# Altium project SBC5.PrjPcb (part 2 of 6)

## Sheet PMIC.SchDoc
size Tabloid; DocumentNumber: 2; SheetNumber: 2; SheetTotal: 13
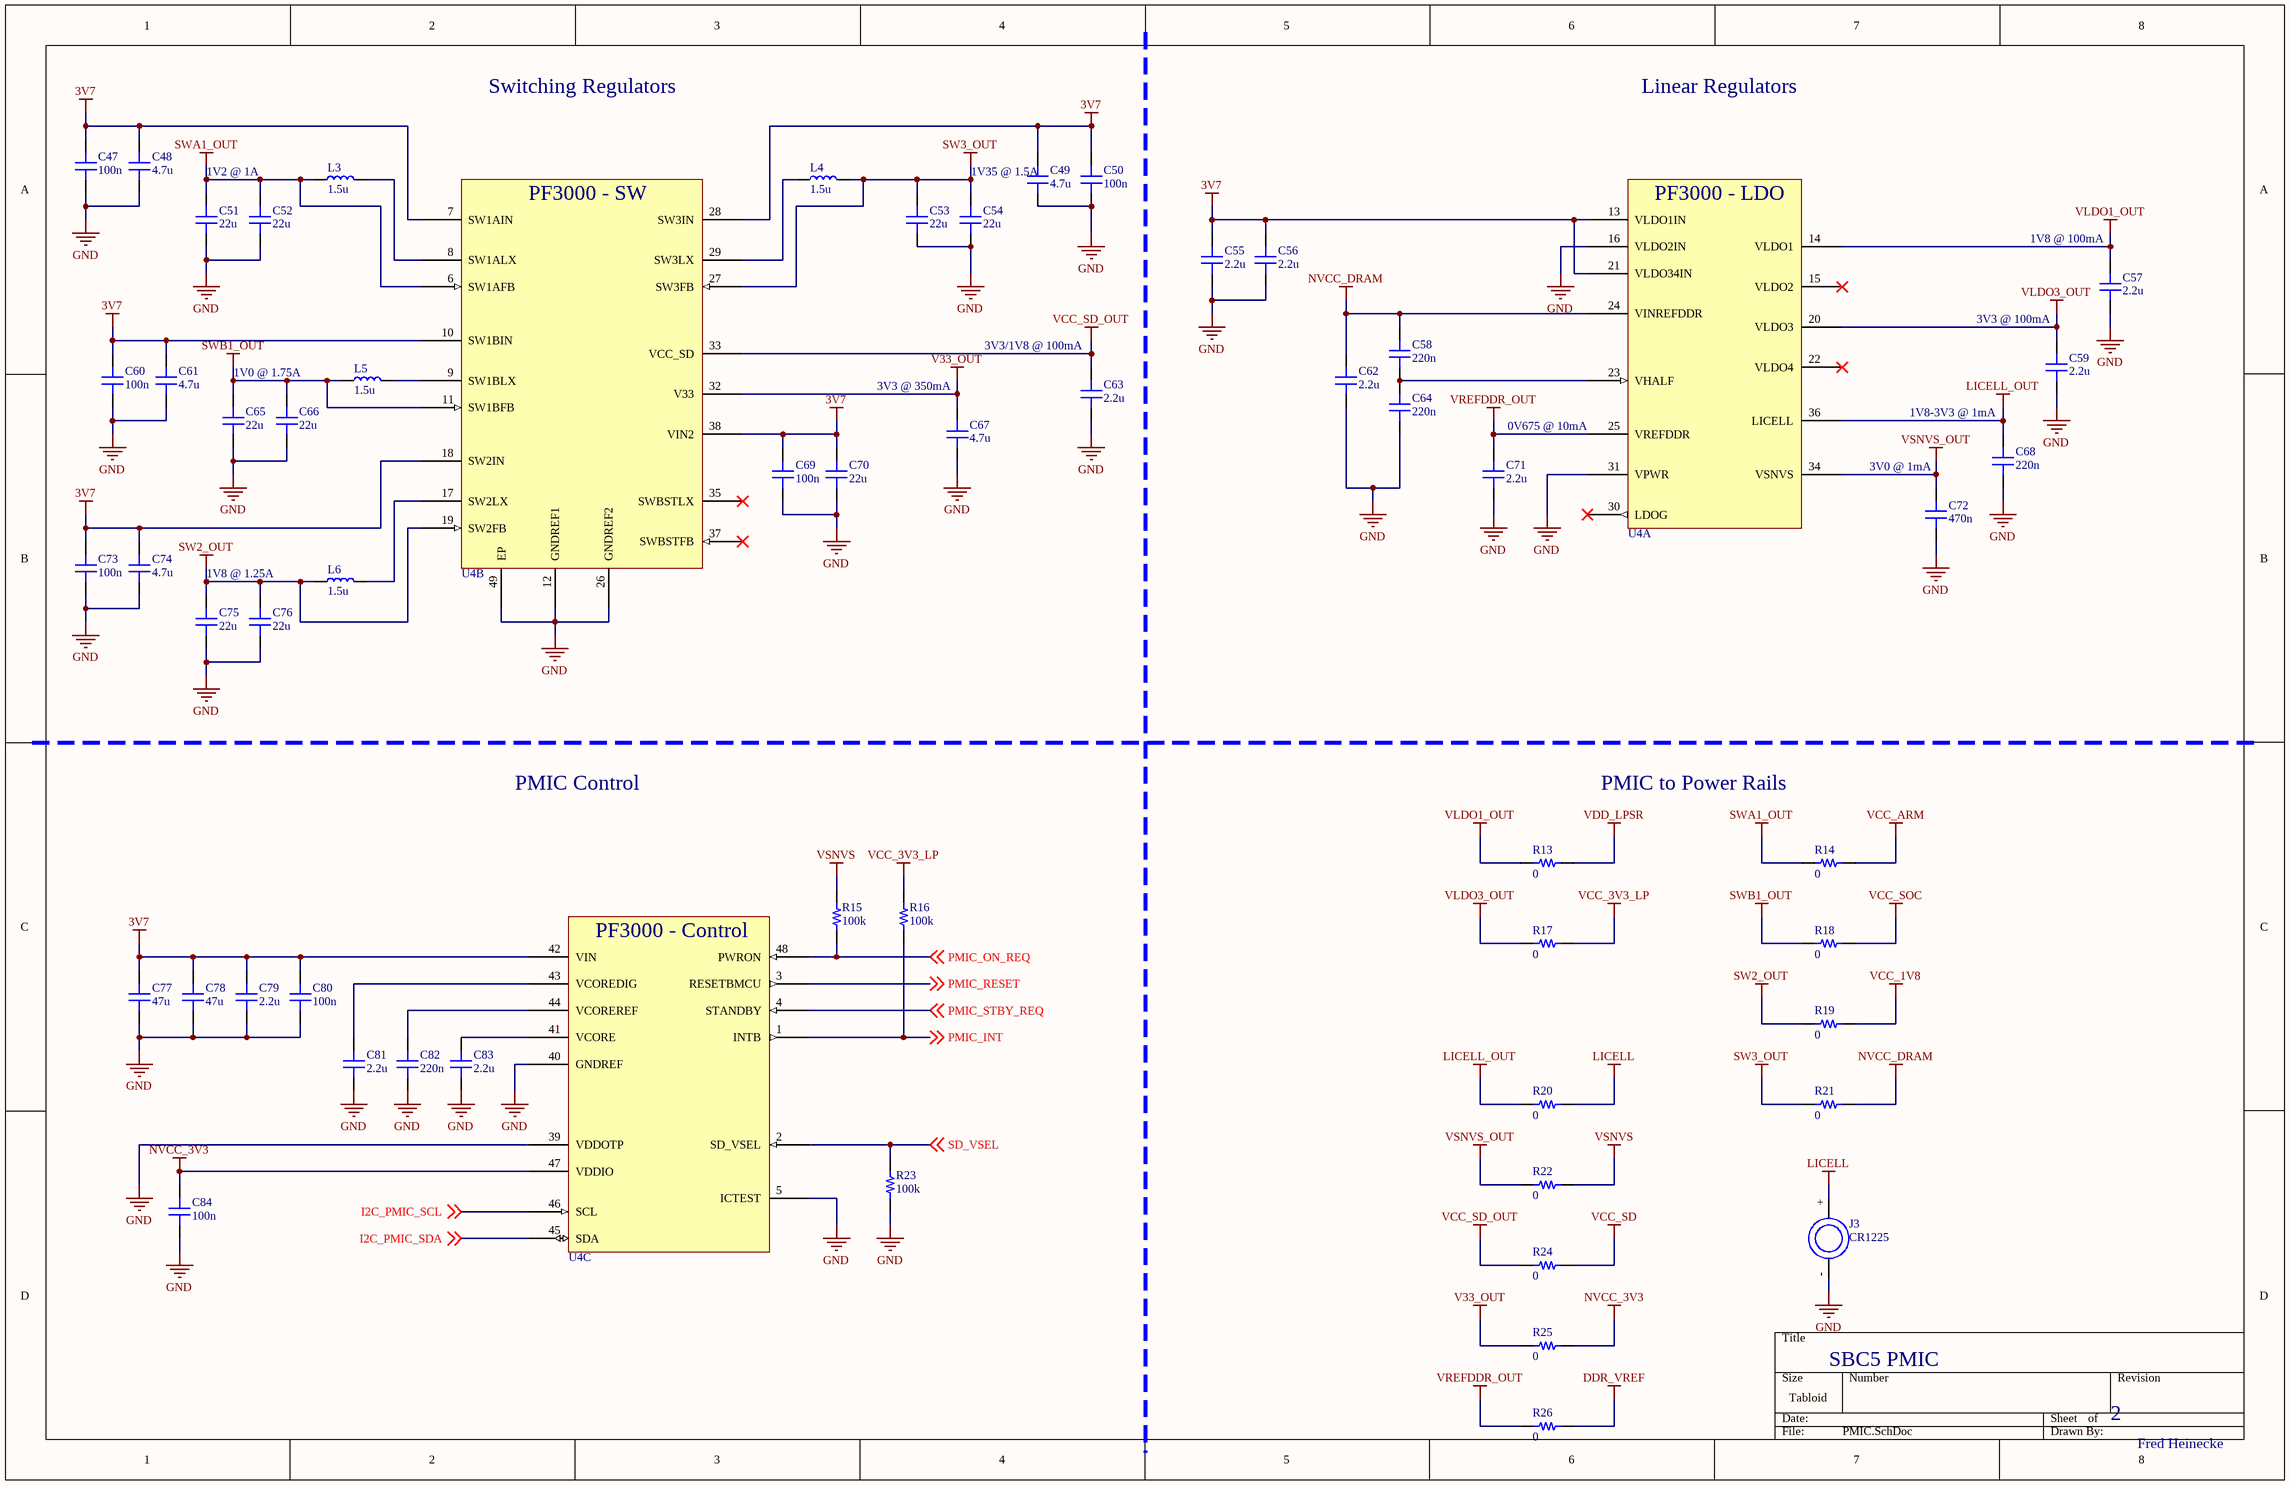
[diagram p1: PMIC.SchDoc]

### Parts
C47  100n  [C0201]
C48  4.7u  [C0603]
C49  4.7u  [C0603]
C50  100n  [C0201]
C51  22u  [C0603]
C52  22u  [C0603]
C53  22u  [C0603]
C54  22u  [C0603]
C55  2.2u  [C0402]
C56  2.2u  [C0402]
C57  2.2u  [C0402]
C58  220n  [C0201]
C59  2.2u  [C0402]
C60  100n  [C0201]
C61  4.7u  [C0603]
C62  2.2u  [C0402]
C63  2.2u  [C0402]
C64  220n  [C0201]
C65  22u  [C0603]
C66  22u  [C0603]
C67  4.7u  [C0603]
C68  220n  [C0201]
C69  100n  [C0201]
C70  22u  [C0603]
C71  2.2u  [C0402]
C72  470n  [C0402]
C73  100n  [C0201]
C74  4.7u  [C0603]
C75  22u  [C0603]
C76  22u  [C0603]
C77  47u  [C0805]
C78  47u  [C0805]
C79  2.2u  [C0402]
C80  100n  [C0201]
C81  2.2u  [C0402]
C82  220n  [C0201]
C83  2.2u  [C0402]
C84  100n  [C0201]
J3  CR1225  [BAT-HLD-012-THM]
L3  1.5u  [L0806]
L4  1.5u  [L0806]
L5  1.5u  [L0806]
L6  1.5u  [L0806]
R13  0  [R0402]
R14  0  [R0402]
R15  100k  [R0201]
R16  100k  [R0201]
R17  0  [R0402]
R18  0  [R0402]
R19  0  [R0402]
R20  0  [R0402]
R21  0  [R0402]
R22  0  [R0402]
R23  100k  [R0201]
R24  0  [R0402]
R25  0  [R0402]
R26  0  [R0402]
U4  PMIC  [PQFN50P700X700X90_HS-49N]  (value not drawn)  (parts A,B,C of 3)

### Nets
3V7: C47.2 C48.2 C49.2 C50.2 C55.2 C56.2 C60.2 C61.2 C69.2 C70.2 C73.2 C74.2 C77.2 C78.2 C79.2 C80.2 U4.7(SW1AIN) U4.10(SW1BIN) U4.13(VLDO1IN) U4.18(SW2IN) U4.21(VLDO34IN) U4.28(SW3IN) U4.38(VIN2) U4.42(VIN)
DDR_VREF: R26.2
GND: C47.1 C48.1 C49.1 C50.1 C51.1 C52.1 C53.1 C54.1 C55.1 C56.1 C57.1 C59.1 C60.1 C61.1 C62.1 C63.1 C64.1 C65.1 C66.1 C67.1 C68.1 C69.1 C70.1 C71.1 C72.1 C73.1 C74.1 C75.1 C76.1 C77.1 C78.1 C79.1 C80.1 C81.1 C82.1 C83.1 C84.1 J3.- R23.1 U4.5(ICTEST) U4.12(GNDREF1) U4.16(VLDO2IN) U4.26(GNDREF2) U4.31(VPWR) U4.39(VDDOTP) U4.40(GNDREF) U4.49(EP)
LICELL: J3.+ R20.2
LICELL_OUT: C68.2 R20.1 U4.36(LICELL)
NVCC_3V3: C84.2 R25.2 U4.47(VDDIO)
NVCC_DRAM: C58.2 C62.2 R21.2 U4.24(VINREFDDR)
SW2_OUT: C75.2 C76.2 L6.1 R19.1 U4.19(SW2FB)
SW3_OUT: C53.2 C54.2 L4.1 R21.1 U4.27(SW3FB)
SWA1_OUT: C51.2 C52.2 L3.1 R14.1 U4.6(SW1AFB)
SWB1_OUT: C65.2 C66.2 L5.1 R18.1 U4.11(SW1BFB)
V33_OUT: C67.2 R25.1 U4.32(V33)
VCC_1V8: R19.2
VCC_3V3_LP: R16.2 R17.2
VCC_ARM: R14.2
VCC_SD: R24.2
VCC_SD_OUT: C63.2 R24.1 U4.33(VCC_SD)
VCC_SOC: R18.2
VDD_LPSR: R13.2
VLDO1_OUT: C57.2 R13.1 U4.14(VLDO1)
VLDO3_OUT: C59.2 R17.1 U4.20(VLDO3)
VREFDDR_OUT: C71.2 R26.1 U4.25(VREFDDR)
VSNVS: R15.2 R22.2
VSNVS_OUT: C72.2 R22.1 U4.34(VSNVS)
I2C_PMIC_SCL: U4.46(SCL) ; off-sheet I2C_PMIC_SCL
I2C_PMIC_SDA: U4.45(SDA) ; off-sheet I2C_PMIC_SDA
PMIC_INT: R16.1 U4.1(INTB) ; off-sheet PMIC_INT
PMIC_ON_REQ: R15.1 U4.48(PWRON) ; off-sheet PMIC_ON_REQ
PMIC_RESET: U4.3(RESETBMCU) ; off-sheet PMIC_RESET
PMIC_STBY_REQ: U4.4(STANDBY) ; off-sheet PMIC_STBY_REQ
SD_VSEL: R23.2 U4.2(SD_VSEL) ; off-sheet SD_VSEL
NetC58_1: C58.1 C64.2 U4.23(VHALF)
NetC81_2: C81.2 U4.43(VCOREDIG)
NetC82_2: C82.2 U4.44(VCOREREF)
NetC83_2: C83.2 U4.41(VCORE)
NetL3_2: L3.2 U4.8(SW1ALX)
NetL4_2: L4.2 U4.29(SW3LX)
NetL5_2: L5.2 U4.9(SW1BLX)
NetL6_2: L6.2 U4.17(SW2LX)

Not connected (* = marked no-connect by the designer): U4 15(VLDO2)* 22(VLDO4)* 30(LDOG)* 35(SWBSTLX)* 37(SWBSTFB)*

### Notes on the sheet
- Switching Regulators
- Linear Regulators
- 1V2 @ 1A
- 1V35 @ 1.5A
- (near C57) 1V8 @ 100mA
- (near C63) 3V3/1V8 @ 100mA
- (near C59) 3V3 @ 100mA
- 1V0 @ 1.75A
- (near C67) 3V3 @ 350mA
- 0V675 @ 10mA
- (near C68) 1V8-3V3 @ 1mA
- (near C72) 3V0 @ 1mA
- 1V8 @ 1.25A
- PMIC Control
- PMIC to Power Rails
- SBC5 PMIC
- 2
- Fred Heinecke
- (in symbol MC34PF3000A4EP, part A) PF3000 - LDO
- (in symbol MC34PF3000A4EP, part B) PF3000 - SW
- (in symbol MC34PF3000A4EP, part C) PF3000 - Control

### Library data of the parts
C47 C50 C60 C69 C73 C80 C84 = GRM033R61C104KE84D: Multilayer Ceramic Capacitors MLCC - SMD/SMT 0201 0.10uF 16volts *Derate Voltage/Temp; Manufacturer: Murata; Capacitance: 100nF; Dielectric: X5R; Voltage Rating: 16V; Tolerance: 10%; Supplier 1: Digi-Key; Supplier Part Number 1: 490-9985-2-ND; Manufacturer Part Number: GRM033R61C104KE84D; RoHS: Yes; Category: Ceramic Capacitors; Stock 1: 2025000; Pricing 1: 15000=0.00770, 30000=0.00732 (USD); Mount: Surface Mount; Case/Package: 0201; Case Code (Metric): 0603; Case Code (Imperial): 0201; Weight: 1.2E-05oz; Min Operating Temperature: -55°C; Max Operating Temperature: 85°C; Packaging: Tape and Reel; Termination: SMD/SMT; Voltage Rating (DC): 16V; Package Quantity: 15000; Length: 0.6mm; Width: 0.012inch; Height: 0.3mm; Thickness: 0.013inch; REACH SVHC: No SVHC; Lead Free: Lead Free; RoHS Compliant: Yes; ComponentLink1URL: http://www.farnell.com/datasheets/2867836.pdf?src-supplier=Farnell; ComponentLink1Description: http://www.farnell.com/datasheets/2867836.pdf?src-supplier=Farnell; ComponentLink2URL: http://components.arrow.com/part/dataview/0323_07280039?src-supplier=Arrow+Europe; ComponentLink2Description: http://components.arrow.com/part/dataview/0323_07280039?src-supplier=Arrow+Europe; ComponentLink3URL: http://www.mouser.com/ds/2/281/c02e-2905.pdf?src-supplier=Mouser; ComponentLink3Description: http://www.mouser.com/ds/2/281/c02e-2905.pdf?src-supplier=Mouser; ComponentLink4URL: http://search.murata.co.jp/Ceramy/image/img/A01X/G101/ENG/GRM033R61C104KE84-01.pdf?src-supplier=Digi-Key; ComponentLink4Description: http://search.murata.co.jp/Ceramy/image/img/A01X/G101/ENG/GRM033R61C104KE84-01.pdf?src-supplier=Digi-Key; ComponentLink5URL: http://psearch.en.murata.com/capacitor/product/GRM033R61C104KE84%23.pdf?src-supplier=Avnet; ComponentLink5Description: http://psearch.en.murata.com/capacitor/product/GRM033R61C104KE84%23.pdf?src-supplier=Avnet; ComponentLink6URL: http://www.farnell.com/datasheets/2867836.pdf?src-supplier=Element14; ComponentLink6Description: http://www.farnell.com/datasheets/2867836.pdf?src-supplier=Element14
C48 C49 C61 C67 C74 = CL10A475KP8NNNC: Cap Ceramic 4.7uF 10V X5R 10% Pad SMD 0603 85C T/R; Manufacturer: Samsung; Supplier 1: Digi-Key; Supplier Part Number 1: 1276-1044-1-ND; Manufacturer Part Number: CL10A475KP8NNNC; RoHS: Yes; Category: Ceramic Capacitors; Stock 1: 3477192; Pricing 1: 1=0.10000, 10=0.04700, 50=0.02560, 100=0.02090, 500=0.01490, 1000=0.01171 (USD); Mount: Surface Mount; Case/Package: 0603; Case Code (Metric): 1608; Case Code (Imperial): 0603; Contact Plating: Tin; Min Operating Temperature: -55°C; Max Operating Temperature: 85°C; Tolerance: 10%; Capacitance: 4.7uF; Dielectric: X5R; Package Quantity: 1; Packaging: Tape and Reel; Voltage Rating: 10V; Series: CL; Construction: Flat; Length: 1.6mm; Width: 0.031inch; Height: 0.8mm; Thickness: 0.035inch; Depth: 0.8mm; Radiation Hardening: No; RoHS Compliant: Yes; ComponentLink1URL: https://datasheet.ciiva.com/25797/cl10a475kp8nnnc-25797520.pdf?src-supplier=Digi-Key; ComponentLink1Description: https://datasheet.ciiva.com/25797/cl10a475kp8nnnc-25797520.pdf?src-supplier=Digi-Key; ComponentLink2URL: https://datasheet.ciiva.com/26838/getdatasheetpartid-358676-26838384.pdf?src-supplier=Verical; ComponentLink2Description: https://datasheet.ciiva.com/26838/getdatasheetpartid-358676-26838384.pdf?src-supplier=Verical; ComponentLink3URL: https://datasheet.ciiva.com/16318/cl05b104kq5nnnc-16318245.pdf?src-supplier=Future+Electronics; ComponentLink3Description: https://datasheet.ciiva.com/16318/cl05b104kq5nnnc-16318245.pdf?src-supplier=Future+Electronics
C51-C54 C65 C66 C70 C75 C76 = GRM188R61A226ME15D: 0603 22 uF 10 V ±20% Tolerance X5R Multilayer Ceramic Chip Capacitor; Manufacturer: Murata; Capacitance: 22uF; Voltage Rating: 10V; Supplier 1: Digi-Key; Manufacturer Part Number: GRM188R61A226ME15D; RoHS: Yes; Category: Ceramic Capacitors; Stock 1: 1418007; Pricing 1: 1=0.30000, 10=0.20500, 50=0.13680, 100=0.11630, 500=0.08210, 1000=0.07184 (USD); Mount: Surface Mount; Case/Package: 0603; Case Code (Metric): 1608; Case Code (Imperial): 0603; Material: Ceramic; Weight: 0.000222oz; Min Operating Temperature: -55°C; Max Operating Temperature: 85°C; Tolerance: 20%; Packaging: Tape and Reel; Dielectric: X5R; Termination: SMD/SMT; Voltage Rating (DC): 10V; Package Quantity: 4000; Length: 1.6mm; Width: 0.8mm; Height: 0.8mm; Thickness: 0.039inch; Depth: 0.8mm; REACH SVHC: No SVHC; Lead Free: Lead Free; ComponentLink1URL: https://datasheet.ciiva.com/46444/1769893-46444975.pdf?src-supplier=Element14; ComponentLink1Description: https://datasheet.ciiva.com/46444/1769893-46444975.pdf?src-supplier=Element14; Supplier Part Number 1: 490-10476-1-ND
C55-C57 C59 C62 C63 C71 C79 C81 C83 = LMK105BJ225MV-F: TAIYO YUDEN         LMK105BJ225MV-F            CERAMIC CAPACITOR, 2.2UF, 10V, X5R, 20%, 0402; Supplier 1: Digi-Key; Manufacturer: Taiyo Yuden; Manufacturer Part Number: LMK105BJ225MV-F; RoHS: Yes; Category: Ceramic Capacitors; Stock 1: 422093; Pricing 1: 1=0.10000, 10=0.05800, 50=0.03160, 100=0.02590, 500=0.01848, 1000=0.01452, 2500=0.01320, 5000=0.01214 (USD); Mount: Surface Mount; Case/Package: 0402; Case Code (Imperial): 0402; Case Code (Metric): 1005; Min Operating Temperature: -55°C; Max Operating Temperature: 85°C; Termination: SMD/SMT; Packaging: Tape and Reel; Capacitance: 2.2uF; Tolerance: 20%; Voltage Rating: 10V; Package Quantity: 1; Voltage Rating (DC): 10V; Dielectric: X5R; Resistor Type: Ceramic; Length: 1mm; Width: 0.5mm; Height: 0.5mm; Thickness: 0.022inch; Depth: 0.5mm; Radiation Hardening: No; Halogen Free: Halogen Free; REACH SVHC: Unknown; ComponentLink1URL: https://datasheet.ciiva.com/30190/500lmk105bj225mv-f-30190498.pdf?src-supplier=Onlinecomponents.com; ComponentLink1Description: https://datasheet.ciiva.com/30190/500lmk105bj225mv-f-30190498.pdf?src-supplier=Onlinecomponents.com; ComponentLink2URL: https://datasheet.ciiva.com/23631/lmk105bj225mv-f-ss-23631491.pdf?src-supplier=Newark; ComponentLink2Description: https://datasheet.ciiva.com/23631/lmk105bj225mv-f-ss-23631491.pdf?src-supplier=Newark; ComponentLink3URL: https://datasheet.ciiva.com/134/lmk105bj225mv-f-ss-134677.pdf?src-supplier=Digi-Key; ComponentLink3Description: https://datasheet.ciiva.com/134/lmk105bj225mv-f-ss-134677.pdf?src-supplier=Digi-Key; ComponentLink4URL: https://datasheet.ciiva.com/15921/286lmk105bj225mv-f-15921222.pdf?src-supplier=Onlinecomponents.com; ComponentLink4Description: https://datasheet.ciiva.com/15921/286lmk105bj225mv-f-15921222.pdf?src-supplier=Onlinecomponents.com; Supplier Part Number 1: 587-3153-1-ND
C58 C64 C68 C82 = GRM033R61C224KE14D: Cap Ceramic Monolithic 0.22uF 16VDC 10% SMD Paper T/R; Manufacturer: Murata; Supplier 1: Digi-Key; Manufacturer Part Number: GRM033R61C224KE14D; RoHS: No; Stock 1: 16192; Pricing 1: 1=0.10000, 10=0.03900, 50=0.02120, 100=0.01720, 500=0.01232, 1000=0.00968, 2500=0.00880, 5000=0.00810 (USD); ComponentLink1URL: https://search.murata.co.jp/Ceramy/image/img/A01X/G101/ENG/GRM033R61C224KE14-01.pdf?src-supplier=Digi-Key; ComponentLink1Description: https://search.murata.co.jp/Ceramy/image/img/A01X/G101/ENG/GRM033R61C224KE14-01.pdf?src-supplier=Digi-Key; Supplier Part Number 1: 490-17040-1-ND
C72 = CL05A474KP5NNNC: Cap Ceramic 0.47uF 10V X5R 10% SMD 0402 85C T/R; Manufacturer: Samsung; Capacitance: 470nF; Supplier 1: Digi-Key; Supplier Part Number 1: 1276-1173-1-ND; Manufacturer Part Number: CL05A474KP5NNNC; RoHS: Yes; Category: Ceramic Capacitors; Stock 1: 1598783; Pricing 1: 1=0.10000, 10=0.06000, 50=0.03260, 100=0.02670, 500=0.01906, 1000=0.01497, 2500=0.01361, 5000=0.01252 (USD); Mount: Surface Mount; Case/Package: 0402; Case Code (Metric): 1005; Case Code (Imperial): 0402; Min Operating Temperature: -55°C; Max Operating Temperature: 85°C; Tolerance: 10%; Dielectric: X5R; Packaging: Tape and Reel; Voltage Rating: 10V; Voltage Rating (DC): 10V; Series: CL; Construction: Flat; Length: 1mm; Width: 0.02inch; Height: 0.5mm; Thickness: 0.022inch; Depth: 0.5mm; Radiation Hardening: No; Lead Free: Lead Free; RoHS Compliant: Yes; ComponentLink1URL: https://datasheet.ciiva.com/25710/cl05a474kp5nnnc-25710324.pdf?src-supplier=Digi-Key; ComponentLink1Description: https://datasheet.ciiva.com/25710/cl05a474kp5nnnc-25710324.pdf?src-supplier=Digi-Key; ComponentLink2URL: https://datasheet.ciiva.com/26838/getdatasheetpartid-355286-26838191.pdf?src-supplier=Verical; ComponentLink2Description: https://datasheet.ciiva.com/26838/getdatasheetpartid-355286-26838191.pdf?src-supplier=Verical; ComponentLink3URL: https://datasheet.ciiva.com/16437/cl05b104kq5nnnc-16437351.pdf?src-supplier=Future+Electronics; ComponentLink3Description: https://datasheet.ciiva.com/16437/cl05b104kq5nnnc-16437351.pdf?src-supplier=Future+Electronics
C77 C78 = C2012X5R1A476M125AC: TDK   C2012X5R1A476M125AC   SMD Multilayer Ceramic Capacitor, C Series, 47 F,  20%, X5R, 10 V, 0805 [2012 Metric]; Capacitance: 47uF; Voltage Rating: 10V; Supplier 1: Digi-Key; Supplier Part Number 1: 445-8239-1-ND; Manufacturer: TDK; Manufacturer Part Number: C2012X5R1A476M125AC; RoHS: Yes; Category: Ceramic Capacitors; Stock 1: 147108; Pricing 1: 1=0.85000, 10=0.64400, 50=0.53460, 100=0.46040, 500=0.35640, 1000=0.30690 (USD); Mount: Surface Mount; Case/Package: 0805; Case Code (Metric): 2012; Case Code (Imperial): 0805; Dielectric Material: Ceramic; Weight: 0.000194oz; Min Operating Temperature: -55°C; Max Operating Temperature: 85°C; Tolerance: 20%; Packaging: Tape and Reel; Voltage Rating (DC): 10V; Dielectric: X5R; Termination: SMD/SMT; Package Quantity: 1; Resistor Type: Ceramic; Voltage: 10V; Series: C; Length: 2mm; Width: 0.049inch; Height: 1.25mm; Depth: 1.25mm; Thickness: 0.057inch; REACH SVHC: No SVHC; Lead Free: Lead Free; RoHS Compliant: Yes; ComponentLink1URL: https://datasheet.ciiva.com/24216/c2012x5r1a476m125ac-264921-24216523.pdf?src-supplier=Mouser; ComponentLink1Description: https://datasheet.ciiva.com/24216/c2012x5r1a476m125ac-264921-24216523.pdf?src-supplier=Mouser; ComponentLink2URL: https://datasheet.ciiva.com/24191/c2012x5r1a476m125ac-24191773.pdf?src-supplier=Future+Electronics; ComponentLink2Description: https://datasheet.ciiva.com/24191/c2012x5r1a476m125ac-24191773.pdf?src-supplier=Future+Electronics; ComponentLink3URL: https://datasheet.ciiva.com/6259/tdkmlcccaprange-6259575.pdf?src-supplier=Digi-Key; ComponentLink3Description: https://datasheet.ciiva.com/6259/tdkmlcccaprange-6259575.pdf?src-supplier=Digi-Key; ComponentLink4URL: https://datasheet.ciiva.com/6259/tdkmlcccaprange-6259576.pdf?src-supplier=Digi-Key; ComponentLink4Description: https://datasheet.ciiva.com/6259/tdkmlcccaprange-6259576.pdf?src-supplier=Digi-Key; ComponentLink5URL: https://datasheet.ciiva.com/6259/tdkmlcccaprange-6259577.pdf?src-supplier=Digi-Key; ComponentLink5Description: https://datasheet.ciiva.com/6259/tdkmlcccaprange-6259577.pdf?src-supplier=Digi-Key; ComponentLink6URL: https://datasheet.ciiva.com/7975/1796654-7975085.pdf?src-supplier=Element14; ComponentLink6Description: https://datasheet.ciiva.com/7975/1796654-7975085.pdf?src-supplier=Element14; ComponentLink7URL: https://datasheet.ciiva.com/22694/1796654-22694142.pdf?src-supplier=Element14; ComponentLink7Description: https://datasheet.ciiva.com/22694/1796654-22694142.pdf?src-supplier=Element14
J3 = BAT-HLD-012-THM: BATTERY RETAINER COIN PC PIN; Manufacturer: Linx; Number of Cells: 1; Supplier 1: Digi-Key; Supplier Part Number 1: BAT-HLD-012-THM-ND; Manufacturer Part Number: BAT-HLD-012-THM; RoHS: Yes; Category: Uncategorized; Stock 1: 1284; Pricing 1: 1=0.29000, 10=0.27800, 25=0.26600, 100=0.24100, 250=0.23000, 500=0.21900, 1000=0.19600, 2000=0.18000, 5000=0.17765 (USD); Mount: Through Hole,PCB; Termination: PC Pin; Package Quantity: 1000; Number of Batteries: 1; Lead Free: Lead Free; ComponentLink1URL: https://datasheet.ciiva.com/4/bat-hld-012-thm-4039.pdf?src-supplier=Digi-Key; ComponentLink1Description: https://datasheet.ciiva.com/4/bat-hld-012-thm-4039.pdf?src-supplier=Digi-Key; ComponentLink2URL: https://datasheet.ciiva.com/4642/bat-hld-012-thm20diagram-201689-4642575.pdf?src-supplier=Mouser; ComponentLink2Description: https://datasheet.ciiva.com/4642/bat-hld-012-thm20diagram-201689-4642575.pdf?src-supplier=Mouser
L3-L6 = DFE201610E-1R5M=P2: Inductor Power Shielded Wirewound 1.5uH 20% 1MHz Metal 2.1A 0.091Ohm DCR 0806 T/R; Manufacturer: Murata; Supplier 1: Digi-Key; Supplier Part Number 1: 490-18107-1-ND; Manufacturer Part Number: DFE201610E-1R5M=P2; RoHS: Yes; Category: Fixed Inductors; Stock 1: 1449; Pricing 1: 1=0.42000, 10=0.36800, 25=0.34120, 50=0.28880, 100=0.26250, 250=0.24676, 500=0.22050, 1000=0.17850 (USD); RoHS Compliant: Yes
R13 R14 R17-R22 R24-R26 = RMCF0402ZT0R00: RES 0 OHM JUMPER 1/16W 0402; Manufacturer: Stackpole Electronics; Resistance: 0R; Power Rating: 63mW; Current Rating: 1A; Working Voltage: 50V; Supplier 1: Digi-Key; Supplier Part Number 1: RMCF0402ZT0R00CT-ND; Manufacturer Part Number: RMCF0402ZT0R00; RoHS: Yes; Category: Chip SMD Resistors; Stock 1: 7645981; Pricing 1: 1=0.10000, 10=0.01000, 25=0.00720, 50=0.00560, 100=0.00410, 250=0.00316, 500=0.00252, 1000=0.00186, 5000=0.00133 (USD); Mount: Surface Mount; Case/Package: 0402; Case Code (Metric): 1005; Case Code (Imperial): 0402; Contact Plating: Tin,Matte; Min Operating Temperature: -55°C; Max Operating Temperature: 155°C; Packaging: Tape and Reel; Resistor Type: Thick Film; Number of Terminations: 2; Max Power Dissipation: 63mW; Features: Automotive AEC-Q200; Series: RMCF; Technology: THICK FILM; Construction: Rectangular; Length: 0.039inch; Width: 0.02inch; Height: 0.016inch; Depth: 0.5mm; Radiation Hardening: No; Military Standard: Not; Lead Free: Lead Free; RoHS Compliant: Yes; ComponentLink1URL: https://datasheet.ciiva.com/26835/getdatasheetpartid-409751-26835612.pdf?src-supplier=Verical; ComponentLink1Description: https://datasheet.ciiva.com/26835/getdatasheetpartid-409751-26835612.pdf?src-supplier=Verical
R15 R16 R23 = ERJ-1GNF1003C: PANASONIC - ERJ1GNF1003C - RES, 100K, 1%, 0.05W, 0201, THICK FILM; Resistance: 100kR; Temperature Coefficient: 200ppm/°C; Power Rating: 50mW; Voltage Rating: 25V; Supplier 1: Digi-Key; Supplier Part Number 1: P122655CT-ND; Manufacturer: Panasonic; Manufacturer Part Number: ERJ-1GNF1003C; RoHS: Yes; Category: Chip SMD Resistors; Stock 1: 833904; Pricing 1: 1=0.10000, 10=0.04600, 100=0.01890, 1000=0.00848, 2500=0.00736, 5000=0.00608 (USD); Mount: Surface Mount; Case/Package: 0201; Number of Pins: 2; Contact Plating: Tin,Matte; Case Code (Metric): 0603; Case Code (Imperial): 0201; Weight: 6E-06oz; Size Code: 0201; Min Operating Temperature: -55°C; Max Operating Temperature: 125°C; Tolerance: 1%; Resistor Type: Thick Film; Packaging: Tape and Reel; Package Quantity: 15000; Number of Terminations: 2; Max Power Dissipation: 50mW; Termination: SMD/SMT; Voltage Rating (DC): 25V; Series: ERJ; Resistance Tolerance: 1%; Length: 0.024inch; Width: 0.012inch; Height: 0.01inch; Radiation Hardening: No; REACH SVHC: No SVHC; Lead Free: Lead Free; RoHS Compliant: Yes; ComponentLink1URL: https://datasheet.ciiva.com/7830/1678782-7830709.pdf?src-supplier=Element14; ComponentLink1Description: https://datasheet.ciiva.com/7830/1678782-7830709.pdf?src-supplier=Element14; ComponentLink2URL: https://datasheet.ciiva.com/16508/aoa0000ce2-16508328.pdf?src-supplier=Future+Electronics; ComponentLink2Description: https://datasheet.ciiva.com/16508/aoa0000ce2-16508328.pdf?src-supplier=Future+Electronics; ComponentLink3URL: https://datasheet.ciiva.com/24161/aoa0000ce2-24161032.pdf?src-supplier=Mouser; ComponentLink3Description: https://datasheet.ciiva.com/24161/aoa0000ce2-24161032.pdf?src-supplier=Mouser; ComponentLink4URL: https://datasheet.ciiva.com/43467/1678782-43467102.pdf?src-supplier=Farnell; ComponentLink4Description: https://datasheet.ciiva.com/43467/1678782-43467102.pdf?src-supplier=Farnell
U4 = MC34PF3000A4EP: Power Management IC, i.MX7, pre-prog, 4 buck, 6 LDO, 1 boost, QFN 48, Tray; Manufacturer: NXP Freescale; Manufacturer Part Number: MC34PF3000A1EP; Stock 1: 360; Pricing 1: 1=5.6, 10=5.027, 100=4.119, 500=3.50642, 1000=2.95722 (USD); Mount: Surface Mount; Case/Package: QFN; Min Operating Temperature: -40°C; Max Operating Temperature: 105°C; Packaging: Tray; ComponentLink1Description: Datasheet; ComponentLink1URL: https://www.nxp.com/docs/en/data-sheet/PF3000.pdf; Supplier 1: Digi-Key; Supplier Part Number 1: MC34PF3000A4EP-ND

## Sheet CPU Power.SchDoc
size D; DocumentNumber: 3; SheetNumber: 3; SheetTotal: 13
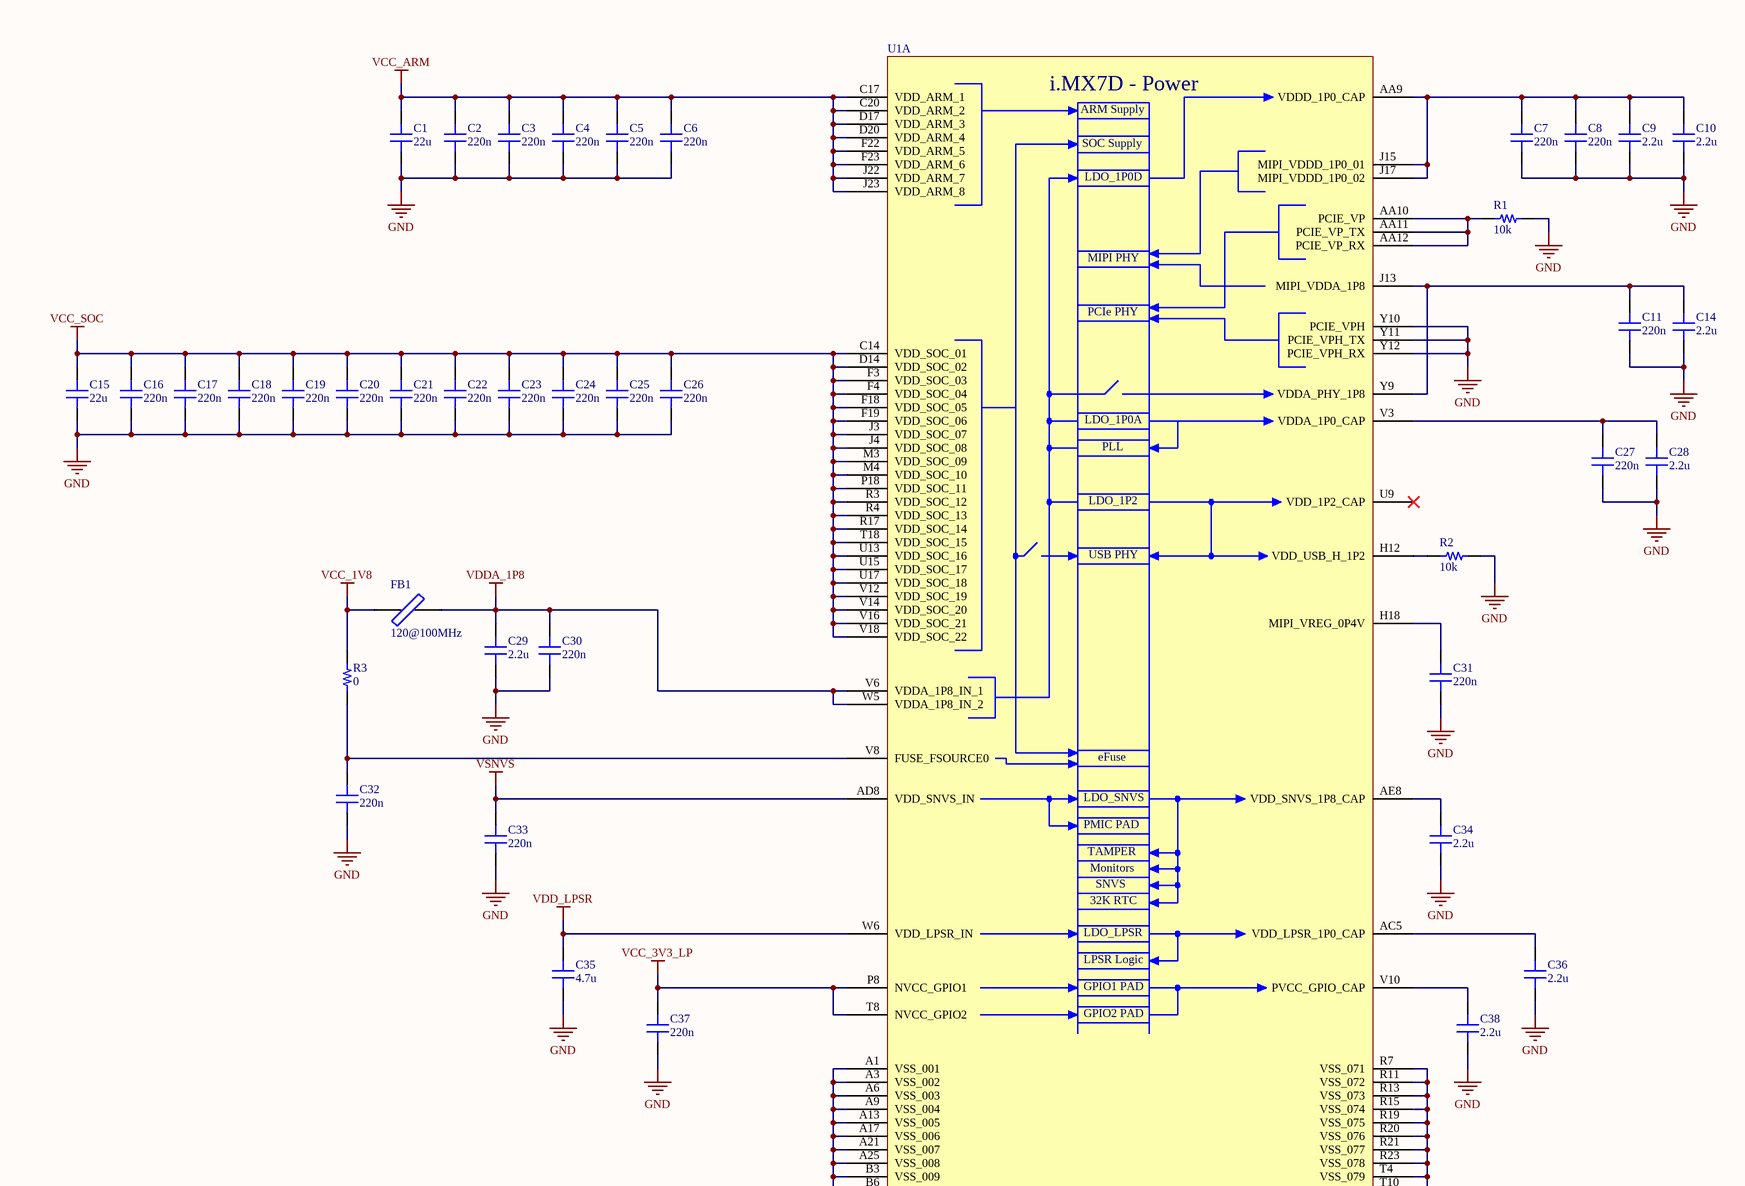
[diagram p2: CPU Power.SchDoc, top left]
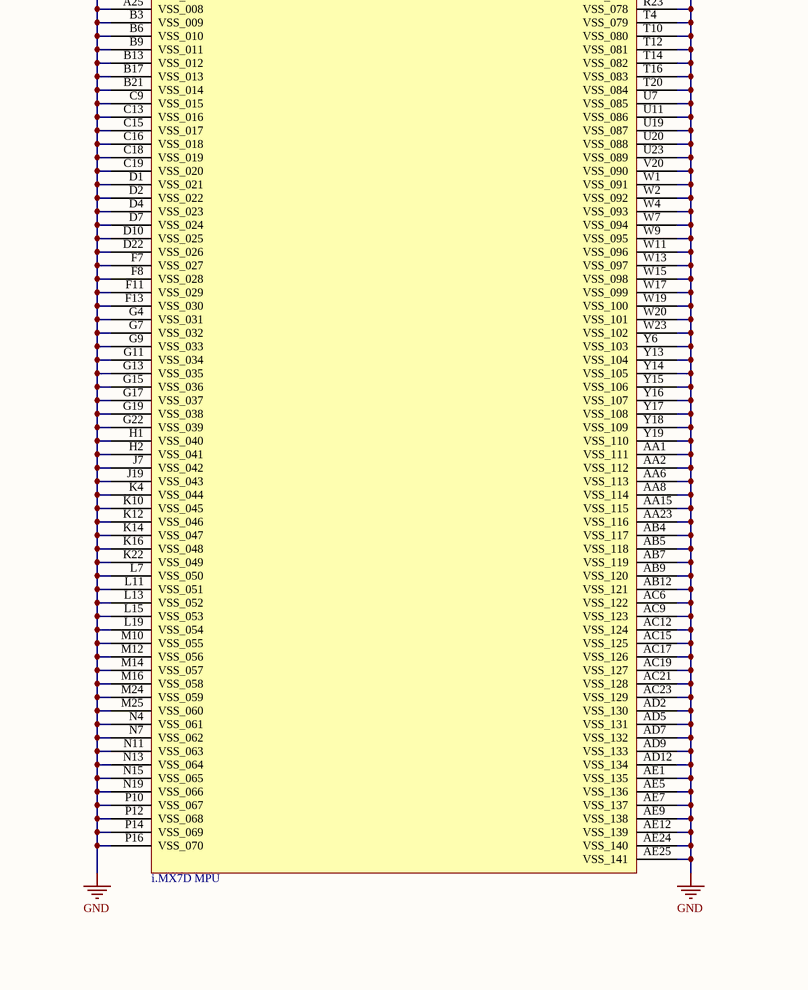
[diagram p3: CPU Power.SchDoc, bottom left]
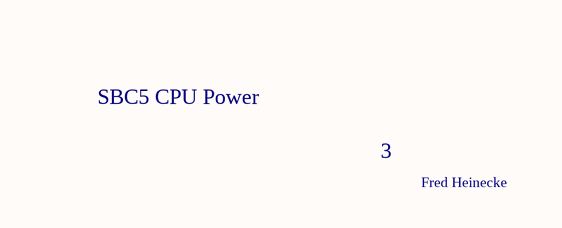
[diagram p4: CPU Power.SchDoc, bottom right]

### Parts
C1  22u  [C0603]
C2  220n  [C0201]
C3  220n  [C0201]
C4  220n  [C0201]
C5  220n  [C0201]
C6  220n  [C0201]
C7  220n  [C0201]
C8  220n  [C0201]
C9  2.2u  [C0402]
C10  2.2u  [C0402]
C11  220n  [C0201]
C14  2.2u  [C0402]
C15  22u  [C0603]
C16  220n  [C0201]
C17  220n  [C0201]
C18  220n  [C0201]
C19  220n  [C0201]
C20  220n  [C0201]
C21  220n  [C0201]
C22  220n  [C0201]
C23  220n  [C0201]
C24  220n  [C0201]
C25  220n  [C0201]
C26  220n  [C0201]
C27  220n  [C0201]
C28  2.2u  [C0402]
C29  2.2u  [C0402]
C30  220n  [C0201]
C31  220n  [C0201]
C32  220n  [C0201]
C33  220n  [C0201]
C34  2.2u  [C0402]
C35  4.7u  [C0603]
C36  2.2u  [C0402]
C37  220n  [C0201]
C38  2.2u  [C0402]
FB1  120@100MHz  [L0402]
R1  10k  [R0201]
R2  10k  [R0201]
R3  0  [R0402]
U1  i.MX7D MPU  [BGA541C75P25X25_1900X1900X140]  (part A of 23)

### Nets
GND: C1.1 C2.1 C3.1 C4.1 C5.1 C6.1 C7.1 C8.1 C9.1 C10.1 C11.1 C14.1 C15.1 C16.1 C17.1 C18.1 C19.1 C20.1 C21.1 C22.1 C23.1 C24.1 C25.1 C26.1 C27.1 C28.1 C29.1 C30.1 C31.1 C32.1 C33.1 C34.1 C35.1 C36.1 C37.1 C38.1 R1.2 R2.2 U1.A1(VSS_001) U1.A3(VSS_002) U1.A6(VSS_003) U1.A9(VSS_004) U1.A13(VSS_005) U1.A17(VSS_006) U1.A21(VSS_007) U1.A25(VSS_008) U1.AA1(VSS_111) U1.AA2(VSS_112) U1.AA6(VSS_113) U1.AA8(VSS_114) U1.AA15(VSS_115) U1.AA23(VSS_116) U1.AB4(VSS_117) U1.AB5(VSS_118) U1.AB7(VSS_119) U1.AB9(VSS_120) U1.AB12(VSS_121) U1.AC6(VSS_122) U1.AC9(VSS_123) U1.AC12(VSS_124) U1.AC15(VSS_125) U1.AC17(VSS_126) U1.AC19(VSS_127) U1.AC21(VSS_128) U1.AC23(VSS_129) U1.AD2(VSS_130) U1.AD5(VSS_131) U1.AD7(VSS_132) U1.AD9(VSS_133) U1.AD12(VSS_134) U1.AE1(VSS_135) U1.AE5(VSS_136) U1.AE7(VSS_137) U1.AE9(VSS_138) U1.AE12(VSS_139) U1.AE24(VSS_140) U1.AE25(VSS_141) U1.B3(VSS_009) U1.B6(VSS_010) U1.B9(VSS_011) U1.B13(VSS_012) U1.B17(VSS_013) U1.B21(VSS_014) U1.C9(VSS_015) U1.C13(VSS_016) U1.C15(VSS_017) U1.C16(VSS_018) U1.C18(VSS_019) U1.C19(VSS_020) U1.D1(VSS_021) U1.D2(VSS_022) U1.D4(VSS_023) U1.D7(VSS_024) U1.D10(VSS_025) U1.D22(VSS_026) U1.F7(VSS_027) U1.F8(VSS_028) U1.F11(VSS_029) U1.F13(VSS_030) U1.G4(VSS_031) U1.G7(VSS_032) U1.G9(VSS_033) U1.G11(VSS_034) U1.G13(VSS_035) U1.G15(VSS_036) U1.G17(VSS_037) U1.G19(VSS_038) U1.G22(VSS_039) U1.H1(VSS_040) U1.H2(VSS_041) U1.J7(VSS_042) U1.J19(VSS_043) U1.K4(VSS_044) U1.K10(VSS_045) U1.K12(VSS_046) U1.K14(VSS_047) U1.K16(VSS_048) U1.K22(VSS_049) U1.L7(VSS_050) U1.L11(VSS_051) U1.L13(VSS_052) U1.L15(VSS_053) U1.L19(VSS_054) U1.M10(VSS_055) U1.M12(VSS_056) U1.M14(VSS_057) U1.M16(VSS_058) U1.M24(VSS_059) U1.M25(VSS_060) U1.N4(VSS_061) U1.N7(VSS_062) U1.N11(VSS_063) U1.N13(VSS_064) U1.N15(VSS_065) U1.N19(VSS_066) U1.P10(VSS_067) U1.P12(VSS_068) U1.P14(VSS_069) U1.P16(VSS_070) U1.R7(VSS_071) U1.R11(VSS_072) U1.R13(VSS_073) U1.R15(VSS_074) U1.R19(VSS_075) U1.R20(VSS_076) U1.R21(VSS_077) U1.R23(VSS_078) U1.T4(VSS_079) U1.T10(VSS_080) U1.T12(VSS_081) U1.T14(VSS_082) U1.T16(VSS_083) U1.T20(VSS_084) U1.U7(VSS_085) U1.U11(VSS_086) U1.U19(VSS_087) U1.U20(VSS_088) U1.U23(VSS_089) U1.V20(VSS_090) U1.W1(VSS_091) U1.W2(VSS_092) U1.W4(VSS_093) U1.W7(VSS_094) U1.W9(VSS_095) U1.W11(VSS_096) U1.W13(VSS_097) U1.W15(VSS_098) U1.W17(VSS_099) U1.W19(VSS_100) U1.W20(VSS_101) U1.W23(VSS_102) U1.Y6(VSS_103) U1.Y10(PCIE_VPH) U1.Y11(PCIE_VPH_TX) U1.Y12(PCIE_VPH_RX) U1.Y13(VSS_104) U1.Y14(VSS_105) U1.Y15(VSS_106) U1.Y16(VSS_107) U1.Y17(VSS_108) U1.Y18(VSS_109) U1.Y19(VSS_110)
VCC_1V8: FB1.1 R3.2
VCC_3V3_LP: C37.2 U1.P8(NVCC_GPIO1) U1.T8(NVCC_GPIO2)
VCC_ARM: C1.2 C2.2 C3.2 C4.2 C5.2 C6.2 U1.C17(VDD_ARM_1) U1.C20(VDD_ARM_2) U1.D17(VDD_ARM_3) U1.D20(VDD_ARM_4) U1.F22(VDD_ARM_5) U1.F23(VDD_ARM_6) U1.J22(VDD_ARM_7) U1.J23(VDD_ARM_8)
VCC_SOC: C15.2 C16.2 C17.2 C18.2 C19.2 C20.2 C21.2 C22.2 C23.2 C24.2 C25.2 C26.2 U1.C14(VDD_SOC_01) U1.D14(VDD_SOC_02) U1.F3(VDD_SOC_03) U1.F4(VDD_SOC_04) U1.F18(VDD_SOC_05) U1.F19(VDD_SOC_06) U1.J3(VDD_SOC_07) U1.J4(VDD_SOC_08) U1.M3(VDD_SOC_09) U1.M4(VDD_SOC_10) U1.P18(VDD_SOC_11) U1.R3(VDD_SOC_12) U1.R4(VDD_SOC_13) U1.R17(VDD_SOC_14) U1.T18(VDD_SOC_15) U1.U13(VDD_SOC_16) U1.U15(VDD_SOC_17) U1.U17(VDD_SOC_18) U1.V12(VDD_SOC_19) U1.V14(VDD_SOC_20) U1.V16(VDD_SOC_21) U1.V18(VDD_SOC_22)
VDD_LPSR: C35.2 U1.W6(VDD_LPSR_IN)
VDDA_1P8: C29.2 C30.2 FB1.2 U1.V6(VDDA_1P8_IN_1) U1.W5(VDDA_1P8_IN_2)
VSNVS: C33.2 U1.AD8(VDD_SNVS_IN)
NetC7_2: C7.2 C8.2 C9.2 C10.2 U1.AA9(VDDD_1P0_CAP) U1.J15(MIPI_VDDD_1P0_01) U1.J17(MIPI_VDDD_1P0_02)
NetC11_2: C11.2 C14.2 U1.J13(MIPI_VDDA_1P8) U1.Y9(VDDA_PHY_1P8)
NetC27_2: C27.2 C28.2 U1.V3(VDDA_1P0_CAP)
NetC31_2: C31.2 U1.H18(MIPI_VREG_0P4V)
NetC32_2: C32.2 R3.1 U1.V8(FUSE_FSOURCE0)
NetC34_2: C34.2 U1.AE8(VDD_SNVS_1P8_CAP)
NetC36_2: C36.2 U1.AC5(VDD_LPSR_1P0_CAP)
NetC38_2: C38.2 U1.V10(PVCC_GPIO_CAP)
NetR1_1: R1.1 U1.AA10(PCIE_VP) U1.AA11(PCIE_VP_TX) U1.AA12(PCIE_VP_RX)
NetR2_1: R2.1 U1.H12(VDD_USB_H_1P2)

Not connected (* = marked no-connect by the designer): U1 U9(VDD_1P2_CAP)*

### Notes on the sheet
- SBC5 CPU Power
- 3
- Fred Heinecke
- (in symbol MCIMX7D2DVM12SD, part A) i.MX7D - Power; ARM Supply; SOC Supply; LDO_1P0D; MIPI PHY; PCIe PHY; LDO_1P0A; PLL; LDO_1P2; USB PHY; eFuse; LDO_SNVS; PMIC PAD; TAMPER; Monitors; SNVS; 32K RTC; LDO_LPSR; LPSR Logic; GPIO1 PAD; GPIO2 PAD

### Library data of the parts
C1 C15 = GRM188R61A226ME15D: as C51 on sheet PMIC; Supplier 1: Digi-Key; Manufacturer Part Number: GRM188R61A226ME15D; RoHS: Yes; Category: Ceramic Capacitors; Stock 1: 1418007; Pricing 1: 1=0.30000, 10=0.20500, 50=0.13680, 100=0.11630, 500=0.08210, 1000=0.07184 (USD); Mount: Surface Mount; Case/Package: 0603; Case Code (Metric): 1608; Case Code (Imperial): 0603; Material: Ceramic; Weight: 0.000222oz; Min Operating Temperature: -55°C; Max Operating Temperature: 85°C; Tolerance: 20%; Packaging: Tape and Reel; Dielectric: X5R; Termination: SMD/SMT; Voltage Rating (DC): 10V; Package Quantity: 4000; Length: 1.6mm; Width: 0.8mm; Height: 0.8mm; Thickness: 0.039inch; Depth: 0.8mm; REACH SVHC: No SVHC; Lead Free: Lead Free; ComponentLink1URL: https://datasheet.ciiva.com/46444/1769893-46444975.pdf?src-supplier=Element14; ComponentLink1Description: https://datasheet.ciiva.com/46444/1769893-46444975.pdf?src-supplier=Element14; Supplier Part Number 1: 490-10476-1-ND
C2-C8 C11 C16-C27 C30-C33 C37 = GRM033R61C224KE14D: as C58 on sheet PMIC; Supplier 1: Digi-Key; Manufacturer Part Number: GRM033R61C224KE14D; RoHS: No; Stock 1: 16192; Pricing 1: 1=0.10000, 10=0.03900, 50=0.02120, 100=0.01720, 500=0.01232, 1000=0.00968, 2500=0.00880, 5000=0.00810 (USD); ComponentLink1URL: https://search.murata.co.jp/Ceramy/image/img/A01X/G101/ENG/GRM033R61C224KE14-01.pdf?src-supplier=Digi-Key; ComponentLink1Description: https://search.murata.co.jp/Ceramy/image/img/A01X/G101/ENG/GRM033R61C224KE14-01.pdf?src-supplier=Digi-Key; Supplier Part Number 1: 490-17040-1-ND
C9 C10 C14 C28 C29 C34 C36 C38 = LMK105BJ225MV-F: as C55 on sheet PMIC; Supplier 1: Digi-Key; Manufacturer: Taiyo Yuden; Manufacturer Part Number: LMK105BJ225MV-F; RoHS: Yes; Category: Ceramic Capacitors; Stock 1: 422093; Pricing 1: 1=0.10000, 10=0.05800, 50=0.03160, 100=0.02590, 500=0.01848, 1000=0.01452, 2500=0.01320, 5000=0.01214 (USD); Mount: Surface Mount; Case/Package: 0402; Case Code (Imperial): 0402; Case Code (Metric): 1005; Min Operating Temperature: -55°C; Max Operating Temperature: 85°C; Termination: SMD/SMT; Packaging: Tape and Reel; Capacitance: 2.2uF; Tolerance: 20%; Voltage Rating: 10V; Package Quantity: 1; Voltage Rating (DC): 10V; Dielectric: X5R; Resistor Type: Ceramic; Length: 1mm; Width: 0.5mm; Height: 0.5mm; Thickness: 0.022inch; Depth: 0.5mm; Radiation Hardening: No; Halogen Free: Halogen Free; REACH SVHC: Unknown; ComponentLink1URL: https://datasheet.ciiva.com/30190/500lmk105bj225mv-f-30190498.pdf?src-supplier=Onlinecomponents.com; ComponentLink1Description: https://datasheet.ciiva.com/30190/500lmk105bj225mv-f-30190498.pdf?src-supplier=Onlinecomponents.com; ComponentLink2URL: https://datasheet.ciiva.com/23631/lmk105bj225mv-f-ss-23631491.pdf?src-supplier=Newark; ComponentLink2Description: https://datasheet.ciiva.com/23631/lmk105bj225mv-f-ss-23631491.pdf?src-supplier=Newark; ComponentLink3URL: https://datasheet.ciiva.com/134/lmk105bj225mv-f-ss-134677.pdf?src-supplier=Digi-Key; ComponentLink3Description: https://datasheet.ciiva.com/134/lmk105bj225mv-f-ss-134677.pdf?src-supplier=Digi-Key; ComponentLink4URL: https://datasheet.ciiva.com/15921/286lmk105bj225mv-f-15921222.pdf?src-supplier=Onlinecomponents.com; ComponentLink4Description: https://datasheet.ciiva.com/15921/286lmk105bj225mv-f-15921222.pdf?src-supplier=Onlinecomponents.com; Supplier Part Number 1: 587-3153-1-ND
C35 = CL10A475KP8NNNC: as C48 on sheet PMIC; Supplier 1: Digi-Key; Supplier Part Number 1: 1276-1044-1-ND; Manufacturer Part Number: CL10A475KP8NNNC; RoHS: Yes; Category: Ceramic Capacitors; Stock 1: 3477192; Pricing 1: 1=0.10000, 10=0.04700, 50=0.02560, 100=0.02090, 500=0.01490, 1000=0.01171 (USD); Mount: Surface Mount; Case/Package: 0603; Case Code (Metric): 1608; Case Code (Imperial): 0603; Contact Plating: Tin; Min Operating Temperature: -55°C; Max Operating Temperature: 85°C; Tolerance: 10%; Capacitance: 4.7uF; Dielectric: X5R; Package Quantity: 1; Packaging: Tape and Reel; Voltage Rating: 10V; Series: CL; Construction: Flat; Length: 1.6mm; Width: 0.031inch; Height: 0.8mm; Thickness: 0.035inch; Depth: 0.8mm; Radiation Hardening: No; RoHS Compliant: Yes; ComponentLink1URL: https://datasheet.ciiva.com/25797/cl10a475kp8nnnc-25797520.pdf?src-supplier=Digi-Key; ComponentLink1Description: https://datasheet.ciiva.com/25797/cl10a475kp8nnnc-25797520.pdf?src-supplier=Digi-Key; ComponentLink2URL: https://datasheet.ciiva.com/26838/getdatasheetpartid-358676-26838384.pdf?src-supplier=Verical; ComponentLink2Description: https://datasheet.ciiva.com/26838/getdatasheetpartid-358676-26838384.pdf?src-supplier=Verical; ComponentLink3URL: https://datasheet.ciiva.com/16318/cl05b104kq5nnnc-16318245.pdf?src-supplier=Future+Electronics; ComponentLink3Description: https://datasheet.ciiva.com/16318/cl05b104kq5nnnc-16318245.pdf?src-supplier=Future+Electronics
FB1 = BLM15PD121SN1D: MURATA - BLM15PD121SN1D - Ferrite Bead, 0402 [1005 Metric], 120 ohm, 1.3 A, BLM15PD Series, 0.09 ohm, ± 25%; Material: Steel,Ferrite; Impedance: 120R; DC Resistance (DCR): 90mR; Max DC Current: 1.3A; Number of Lines: 1; Test Frequency: 100MHz; Supplier 1: Digi-Key; Supplier Part Number 1: 490-5203-1-ND; Manufacturer: Murata; Manufacturer Part Number: BLM15PD121SN1D; RoHS: Yes; Category: Inductors; Stock 1: 519984; Pricing 1: 1=0.10000, 10=0.07900, 25=0.07080, 50=0.05180, 100=0.04480, 250=0.03536, 500=0.02984, 1000=0.02514, 5000=0.02239 (USD); Case/Package: 0402; Number of Pins: 2; Core Material: Ferrite; Case Code (Metric): 1005; Case Code (Imperial): 0402; Min Operating Temperature: -55°C; Max Operating Temperature: 125°C; Tolerance: 25%; Package Quantity: 1; Packaging: Tape and Reel; Current Rating: 1.3A; Max Current Rating: 1.3A; Termination: SMD/SMT; DC Current: 1.3A; Number of Circuits: 1; Series: BLM15PD; DC Resistance-Max: 90mR; Length: 1mm; Width: 0.5mm; Height: 0.5mm; Depth: 0.55mm; Radiation Hardening: No; REACH SVHC: No SVHC; Military Standard: Not; Lead Free: Lead Free; RoHS Compliant: Yes; ComponentLink1URL: https://datasheet.ciiva.com/18093/getdatasheetpartid-195858-18093157.pdf?src-supplier=Verical; ComponentLink1Description: https://datasheet.ciiva.com/18093/getdatasheetpartid-195858-18093157.pdf?src-supplier=Verical; ComponentLink2URL: https://datasheet.ciiva.com/11800/0900766b811b5866-11800860.pdf?src-supplier=RSComponents; ComponentLink2Description: https://datasheet.ciiva.com/11800/0900766b811b5866-11800860.pdf?src-supplier=RSComponents; ComponentLink3URL: https://datasheet.ciiva.com/41425/001171686-da-01-en-chip-drossel0402-120r-1300ma-1-0x0-5mm-41425776.pdf?src-supplier=Conrad; ComponentLink3Description: https://datasheet.ciiva.com/41425/001171686-da-01-en-chip-drossel0402-120r-1300ma-1-0x0-5mm-41425776.pdf?src-supplier=Conrad; ComponentLink4URL: https://datasheet.ciiva.com/41449/001172205-da-01-en-drossel-0402-120r-11-0x0-5mm-10000st-41449495.pdf?src-supplier=Conrad; ComponentLink4Description: https://datasheet.ciiva.com/41449/001172205-da-01-en-drossel-0402-120r-11-0x0-5mm-10000st-41449495.pdf?src-supplier=Conrad; ComponentLink5URL: https://datasheet.ciiva.com/1012/l0110e-1012434.pdf?src-supplier=Digi-Key; ComponentLink5Description: https://datasheet.ciiva.com/1012/l0110e-1012434.pdf?src-supplier=Digi-Key; ComponentLink6URL: https://datasheet.ciiva.com/1012/l0110e-1012435.pdf?src-supplier=Digi-Key; ComponentLink6Description: https://datasheet.ciiva.com/1012/l0110e-1012435.pdf?src-supplier=Digi-Key; ComponentLink7URL: https://datasheet.ciiva.com/1012/l0110e-1012436.pdf?src-supplier=Digi-Key; ComponentLink7Description: https://datasheet.ciiva.com/1012/l0110e-1012436.pdf?src-supplier=Digi-Key
R1 R2 = RMCF0201FT10K0: RES 10K OHM 1% 1/20W 0201; Manufacturer: Stackpole Electronics; Max Power Dissipation: 50mW; Temperature Coefficient: 200ppm/°C; Resistance: 10kR; Supplier 1: Digi-Key; Manufacturer Part Number: RMCF0201FT10K0; RoHS: Yes; Category: Chip SMD Resistors; Stock 1: 1526173; Pricing 1: 1=0.10000, 10=0.02300, 100=0.00940, 1000=0.00424, 2500=0.00368, 5000=0.00304 (USD); Mount: Surface Mount; Case/Package: 0201; Contact Plating: Tin,Matte; Case Code (Imperial): 0201; Case Code (Metric): 0603; Min Operating Temperature: -55°C; Max Operating Temperature: 125°C; Resistor Type: Thick Film; Number of Terminations: 2; Packaging: Tape and Reel; Tolerance: 1%; Power Rating: 50mW; Length: 0.024inch; Width: 0.012inch; Height: 0.009inch; ComponentLink1URL: https://www.seielect.com/catalog/SEI-Packaging.pdf?src-supplier=Digi-Key; ComponentLink1Description: https://www.seielect.com/catalog/SEI-Packaging.pdf?src-supplier=Digi-Key; ComponentLink2URL: https://www.seielect.com/Catalog/SEI-RMCF_RMCP.pdf?src-supplier=Avnet+Asia; ComponentLink2Description: https://www.seielect.com/Catalog/SEI-RMCF_RMCP.pdf?src-supplier=Avnet+Asia; ComponentLink3URL: https://www.seielect.com/Catalog/SEI-RMCF_RMCP.pdf?src-supplier=Avnet; ComponentLink3Description: https://www.seielect.com/Catalog/SEI-RMCF_RMCP.pdf?src-supplier=Avnet; ComponentLink4URL: https://www.seielect.com/Catalog/SEI-RMCF_RMCP.pdf?src-supplier=Digi-Key; ComponentLink4Description: https://www.seielect.com/Catalog/SEI-RMCF_RMCP.pdf?src-supplier=Digi-Key; Supplier Part Number 1: RMCF0201FT10K0CT-ND
R3 = RMCF0402ZT0R00: as R13 on sheet PMIC; Supplier 1: Digi-Key; Supplier Part Number 1: RMCF0402ZT0R00CT-ND; Manufacturer Part Number: RMCF0402ZT0R00; RoHS: Yes; Category: Chip SMD Resistors; Stock 1: 7645981; Pricing 1: 1=0.10000, 10=0.01000, 25=0.00720, 50=0.00560, 100=0.00410, 250=0.00316, 500=0.00252, 1000=0.00186, 5000=0.00133 (USD); Mount: Surface Mount; Case/Package: 0402; Case Code (Metric): 1005; Case Code (Imperial): 0402; Contact Plating: Tin,Matte; Min Operating Temperature: -55°C; Max Operating Temperature: 155°C; Packaging: Tape and Reel; Resistor Type: Thick Film; Number of Terminations: 2; Max Power Dissipation: 63mW; Features: Automotive AEC-Q200; Series: RMCF; Technology: THICK FILM; Construction: Rectangular; Length: 0.039inch; Width: 0.02inch; Height: 0.016inch; Depth: 0.5mm; Radiation Hardening: No; Military Standard: Not; Lead Free: Lead Free; RoHS Compliant: Yes; ComponentLink1URL: https://datasheet.ciiva.com/26835/getdatasheetpartid-409751-26835612.pdf?src-supplier=Verical; ComponentLink1Description: https://datasheet.ciiva.com/26835/getdatasheetpartid-409751-26835612.pdf?src-supplier=Verical
U1 = MCIMX7D2DVM12SD: Heterogeneous Multicore Processing Architecture; Manufacturer: NXP Freescale; Manufacturer Part Number: MCIMX7D2DVM12SD; Stock 1: 0; Pricing 1: 168=18.42238 (USD); ComponentLink1Description: Datasheet; ComponentLink1URL: https://www.nxp.com/docs/en/data-sheet/IMX7DCEC.pdf; ComponentLink2Description: Reference manual; ComponentLink2URL: https://www.nxp.com/docs/en/reference-manual/IMX7DRM.pdf; ComponentLink3Description: Hardware Development Guide; ComponentLink3URL: https://www.nxp.com/docs/en/user-guide/IMX7DSHDG.pdf; Supplier 1: Digi-Key; Supplier Part Number 1: 568-15401-ND